# Altium schematic sheet sheet3_memory.SchDoc
size A4
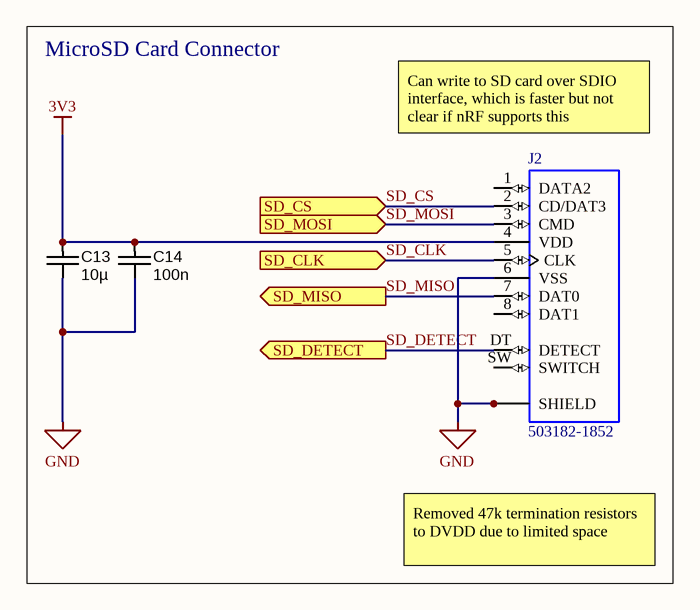
[diagram p0: sheet3_memory.SchDoc]

## Parts
C13  value 10µ  [CAPC2012X135N]  (hidden comment: approved sub OK)
C14  100n  [CAPC1005X55N]
J2  503182-1852  [MOLEX_503182-1852]

## Blocks framed on the sheet
MicroSD Card Connector: C13 C14 J2

## Ports
SD_CLK (in), SD_CS (in), SD_DETECT (out), SD_MISO (out), SD_MOSI (in)

## Nets
3V3: C13.1 C14.1 J2.4(VDD)
GND: C13.2 C14.2 J2.6(VSS) J2.P1(SHIELD) J2.P2(SHIELD) J2.P3(SHIELD) J2.P4(SHIELD) J2.P5(SHIELD)
SD_CLK: J2.5(CLK) ; port SD_CLK
SD_CS: J2.2(CD/DAT3) ; port SD_CS
SD_DETECT: J2.DT(DETECT) ; port SD_DETECT
SD_MISO: J2.7(DAT0) ; port SD_MISO
SD_MOSI: J2.3(CMD) ; port SD_MOSI

Not connected (* = marked no-connect by the designer): J2 1(DATA2) 8(DAT1) SW(SWITCH)

## Notes on the sheet
- (near J2) Can write to SD card over SDIO interface, which is faster but not clear if nRF supports this
- Removed 47k termination resistors to DVDD due to limited space

## Library data of the parts
C13 = CAPC_10u_0805_10V: Capacitor SMD Cer 10uF 10% 10V X5R 0805; Manufacturer 1: AVX Corporation; Manufacturer Part Number 1: 0805ZD106KAT2A; Ratings: 10V; X5R; Material: ceramic; SCDType: spec; Package / Case: 0805 (2012 metric); Tolerance: ±10%; Manufacturer 2: Kemet; Manufacturer Part Number 2: C0805C106K8PACTU; Supplier 1: Digi-Key; Supplier Part Number 1: 478-5167-1-ND; ComponentLink1URL: http://www.avx.com/docs/Catalogs/cx5r.pdf; ComponentLink1Description: http://www.avx.com/docs/Catalogs/cx5r.pdf; ComponentLink2URL: http://www.kemet.com/datasheets&C0805C106K8PACTU; ComponentLink2Description: http://www.kemet.com/datasheets&C0805C106K8PACTU; Supplier 2: Digi-Key; Supplier Part Number 2: 399-4925-1-ND
C14 = CAPC_100n_0402_X5R_16V_10%: Capacitor SMD Cer 100nF 10% 16V X5R 0402; Manufacturer 1: AVX Corporation; Manufacturer Part Number 1: 0402YD104KAT2A; Ratings: 16V; X5R; SCDType: spec; Tolerance: ±10%; Operating Temperature: -55°C ~ 125°C; Package / Case: 0402 (1005 Metric); Size / Dimension: 0.039" L x 0.020" W (1.00mm x 0.50mm); Supplier 1: Digi-Key; Supplier Part Number 1: 478-1126-1-ND; ComponentLink1URL: http://www.avx.com/docs/Catalogs/cx5r.pdf; ComponentLink1Description: http://www.avx.com/docs/Catalogs/cx5r.pdf; Supplier 2: Digi-Key; Supplier Part Number 2: 311-1347-1-ND; Manufacturer 2: Yageo; Manufacturer Part Number 2: CC0402KRX5R7BB104; ComponentLink2URL: http://www.yageo.com/documents/recent/UPY-GPHC_X5R_4V-to-50V_12.pdf; ComponentLink2Description: http://www.yageo.com/documents/recent/UPY-GPHC_X5R_4V-to-50V_12.pdf; Value: 100n
J2 = 503182-1852: 10 _8 + 2_ Position Card Connector microSDâ„¢ Surface Mount, Right Angle Gold; MF: Molex; MP: 5031821852; Digi-Key_Part_Number: WM12834CT-ND; Digi-Key_Purchase_URL: https://www.digikey.com.tr/product-detail/en/molex/5031821852/WM12834CT-ND/5823232?utm_source=snapeda&utm_medium=aggregator&utm_campaign=symbol; SnapEDA_Link: https://www.snapeda.com/parts/5031821852/Molex/view-part/46835/?ref=snap; Value: *; Package: None